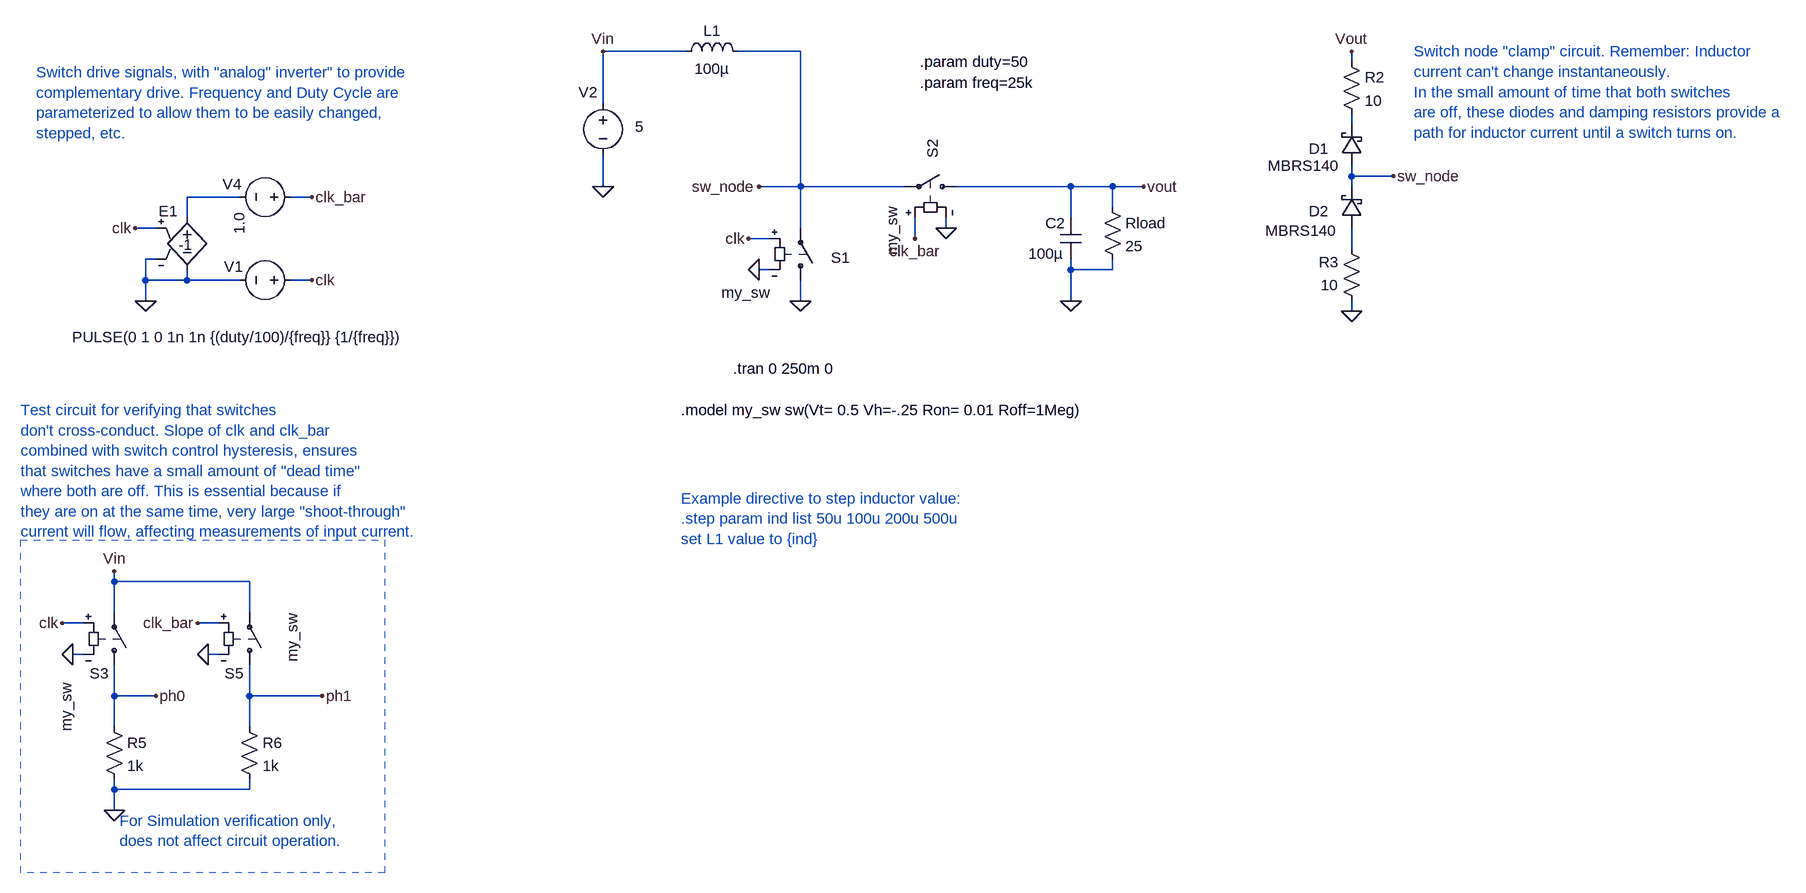
[diagram p0: schematic OL_Boost_concept_ideal_sw.asc]
OL_Boost_concept_ideal_sw.asc, the LTspice schematic file:
Version 4
SHEET 1 2776 696
WIRE 192 -608 64 -608
WIRE 368 -608 272 -608
WIRE 1216 -592 1216 -608
WIRE 64 -528 64 -608
WIRE 1216 -496 1216 -512
WIRE 1216 -416 1216 -432
WIRE 1280 -416 1216 -416
WIRE 64 -400 64 -448
WIRE 368 -400 368 -608
WIRE 368 -400 304 -400
WIRE 528 -400 368 -400
WIRE 784 -400 608 -400
WIRE 848 -400 784 -400
WIRE 896 -400 848 -400
WIRE 1216 -400 1216 -416
WIRE -496 -384 -576 -384
WIRE -384 -384 -416 -384
WIRE 848 -368 848 -400
WIRE -576 -352 -576 -384
WIRE 784 -352 784 -400
WIRE -624 -336 -656 -336
WIRE 368 -336 368 -400
WIRE 592 -336 592 -352
WIRE 320 -320 288 -320
WIRE 544 -320 544 -352
WIRE 1216 -304 1216 -336
WIRE -624 -288 -640 -288
WIRE 320 -272 304 -272
WIRE 784 -272 784 -288
WIRE 848 -272 848 -288
WIRE 848 -272 784 -272
WIRE -640 -256 -640 -288
WIRE -576 -256 -576 -272
WIRE -576 -256 -640 -256
WIRE -496 -256 -576 -256
WIRE -384 -256 -416 -256
WIRE -640 -224 -640 -256
WIRE 368 -224 368 -256
WIRE 784 -224 784 -272
WIRE 1216 -208 1216 -224
WIRE -688 208 -688 192
WIRE -480 208 -688 208
WIRE -688 256 -688 208
WIRE -480 256 -480 208
WIRE -736 272 -768 272
WIRE -528 272 -560 272
WIRE -736 320 -752 320
WIRE -528 320 -544 320
WIRE -688 384 -688 336
WIRE -624 384 -688 384
WIRE -480 384 -480 336
WIRE -368 384 -480 384
WIRE -688 432 -688 384
WIRE -480 432 -480 384
WIRE -688 528 -688 512
WIRE -480 528 -480 512
WIRE -480 528 -688 528
WIRE -688 560 -688 528
FLAG -384 -256 clk
FLAG 592 -336 0
FLAG 544 -320 clk_bar
FLAG 64 -400 0
FLAG 64 -608 Vin
FLAG 784 -224 0
FLAG -640 -224 0
FLAG 304 -272 0
FLAG 368 -224 0
FLAG 896 -400 vout
FLAG -656 -336 clk
FLAG -384 -384 clk_bar
FLAG 288 -320 clk
FLAG -752 320 0
FLAG -768 272 clk
FLAG -688 192 Vin
FLAG -544 320 0
FLAG -560 272 clk_bar
FLAG -688 560 0
FLAG -624 384 ph0
FLAG -368 384 ph1
FLAG 304 -400 sw_node
FLAG 1216 -608 Vout
FLAG 1216 -208 0
FLAG 1280 -416 sw_node
SYMBOL sw 624 -400 M270
WINDOW 0 44 53 Left 2
WINDOW 3 -31 115 Right 2
SYMATTR InstName S2
SYMATTR Value my_sw
SYMBOL voltage -400 -256 R90
WINDOW 123 0 0 Left 2
WINDOW 39 0 0 Left 2
WINDOW 3 88 -163 VRight 2
WINDOW 0 -21 90 VRight 2
SYMATTR Value PULSE(0 1 0 1n 1n {(duty/100)/{freq}} {1/{freq}})
SYMATTR InstName V1
SYMBOL voltage 64 -544 R0
WINDOW 123 0 0 Left 2
WINDOW 39 0 0 Left 2
WINDOW 0 -38 -1 Left 2
WINDOW 3 49 52 Left 2
SYMATTR InstName V2
SYMATTR Value 5
SYMBOL cap 768 -352 R0
WINDOW 0 -23 8 Left 2
WINDOW 3 -49 55 Left 2
SYMATTR InstName C2
SYMATTR Value 100µ
SYMBOL res 832 -384 R0
SYMATTR InstName Rload
SYMATTR Value 25
SYMBOL ind 176 -592 R270
WINDOW 0 32 56 VTop 2
WINDOW 3 5 56 VBottom 2
SYMATTR InstName L1
SYMATTR Value 100µ
SYMBOL sw 368 -240 M180
WINDOW 0 47 51 Left 2
WINDOW 3 -47 -3 Right 2
SYMATTR InstName S1
SYMATTR Value my_sw
SYMBOL schottky 1232 -432 R180
WINDOW 0 51 26 Left 2
WINDOW 3 35 0 Left 2
SYMATTR InstName D1
SYMATTR Value MBRS140
SYMATTR Description Diode
SYMATTR Type diode
SYMBOL e -576 -368 R0
WINDOW 0 -44 6 Left 2
WINDOW 3 -13 57 Left 2
SYMATTR InstName E1
SYMATTR Value -1
SYMBOL voltage -400 -384 R90
WINDOW 123 0 0 Left 2
WINDOW 39 0 0 Left 2
WINDOW 0 -20 92 VRight 2
SYMATTR InstName V4
SYMATTR Value 1.0
SYMBOL res 1200 -608 R0
SYMATTR InstName R2
SYMATTR Value 10
SYMBOL res 1232 -208 R180
WINDOW 0 36 76 Left 2
WINDOW 3 36 40 Left 2
SYMATTR InstName R3
SYMATTR Value 10
SYMBOL sw -688 352 M180
WINDOW 0 -38 3 Left 2
WINDOW 3 -74 -12 VLeft 2
SYMATTR InstName S3
SYMATTR Value my_sw
SYMBOL sw -480 352 M180
WINDOW 0 -38 3 Left 2
WINDOW 3 66 95 VLeft 2
SYMATTR InstName S5
SYMATTR Value my_sw
SYMBOL res -704 416 R0
SYMATTR InstName R5
SYMATTR Value 1k
SYMBOL res -496 416 R0
SYMATTR InstName R6
SYMATTR Value 1k
SYMBOL schottky 1232 -336 R180
WINDOW 0 51 26 Left 2
WINDOW 3 39 -4 Left 2
SYMATTR InstName D2
SYMATTR Value MBRS140
SYMATTR Description Diode
SYMATTR Type diode
TEXT 184 -56 Left 2 !.model my_sw sw(Vt= 0.5 Vh=-.25 Ron= 0.01 Roff=1Meg)
TEXT 264 -120 Left 2 !.tran 0 250m 0
TEXT 552 -592 Left 2 !.param duty=50
TEXT 552 -560 Left 2 !.param freq=25k
TEXT -832 -56 Left 2 ;Test circuit for verifying that switches\ndon't cross-conduct. Slope of clk and clk_bar\ncombined with switch control hysteresis, ensures\nthat switches have a small amount of "dead time"\nwhere both are off. This is essential because if\nthey are on at the same time, very large "shoot-through"\ncurrent will flow, affecting measurements of input current.
TEXT 184 80 Left 2 ;Example directive to step inductor value:\n.step param ind list 50u 100u 200u 500u\nset L1 value to {ind}
TEXT 1312 -608 Left 2 ;Switch node "clamp" circuit. Remember: Inductor\ncurrent can't change instantaneously.\nIn the small amount of time that both switches\nare off, these diodes and damping resistors provide a\npath for inductor current until a switch turns on.
TEXT -808 -576 Left 2 ;Switch drive signals, with "analog" inverter" to provide\ncomplementary drive. Frequency and Duty Cycle are\nparameterized to allow them to be easily changed,\nstepped, etc.
TEXT -680 576 Left 2 ;For Simulation verification only,\ndoes not affect circuit operation.
RECTANGLE Normal -272 656 -832 144 2

The netlist it stands for:
* OL_Boost_concept_ideal_sw.asc
S2 vout sw_node clk_bar 0 my_sw
V1 clk 0 PULSE(0 1 0 1n 1n {(duty/100)/{freq}} {1/{freq}})
V2 Vin 0 5
C2 vout 0 100µ
Rload vout 0 25
L1 Vin sw_node 100µ
S1 0 sw_node clk 0 my_sw
D1 sw_node N001 MBRS140
E1 N002 0 clk 0 -1
V4 clk_bar N002 1.0
R2 vout N001 10
R3 0 N003 10
S3 ph0 Vin clk 0 my_sw
S5 ph1 Vin clk_bar 0 my_sw
R5 ph0 0 1k
R6 ph1 0 1k
D2 N003 sw_node MBRS140
.model D D
.lib standard.dio
.model my_sw sw(Vt= 0.5 Vh=-.25 Ron= 0.01 Roff=1Meg)
.tran 0 250m 0
.param duty=50
.param freq=25k
* Test circuit for verifying that switches
* don't cross-conduct. Slope of clk and clk_bar
* combined with switch control hysteresis, ensures
* that switches have a small amount of "dead time"
* where both are off. This is essential because if
* they are on at the same time, very large "shoot-through"
* current will flow, affecting measurements of input current.
* Example directive to step inductor value:
* .step param ind list 50u 100u 200u 500u
* set L1 value to {ind}
* Switch node "clamp" circuit. Remember: Inductor
* current can't change instantaneously.
* In the small amount of time that both switches
* are off, these diodes and damping resistors provide a
* path for inductor current until a switch turns on.
* Switch drive signals, with "analog" inverter" to provide
* complementary drive. Frequency and Duty Cycle are
* parameterized to allow them to be easily changed,
* stepped, etc.
* For Simulation verification only,
* does not affect circuit operation.
.backanno
.end